# Altium schematic sheet LPCB220 - WATCHDOG.SchDoc
size A3; Address1: Factory 10; Address2: 9-13 Dingley Avenue, Dandeong, VICTORIA 3175, AUSTRALIA; DocumentNumber: 18; Revision: 1; SheetNumber: 18; SheetTotal: 18; Lockie__PCB_SUB_ASSEMBLY: Watchdog; Lockie__PCB_ASSEMBLY: Brake Control; Lockie__LDL: LPCB220; Lockie__PCB_DESCRIPTION: Redundant Stepper Node
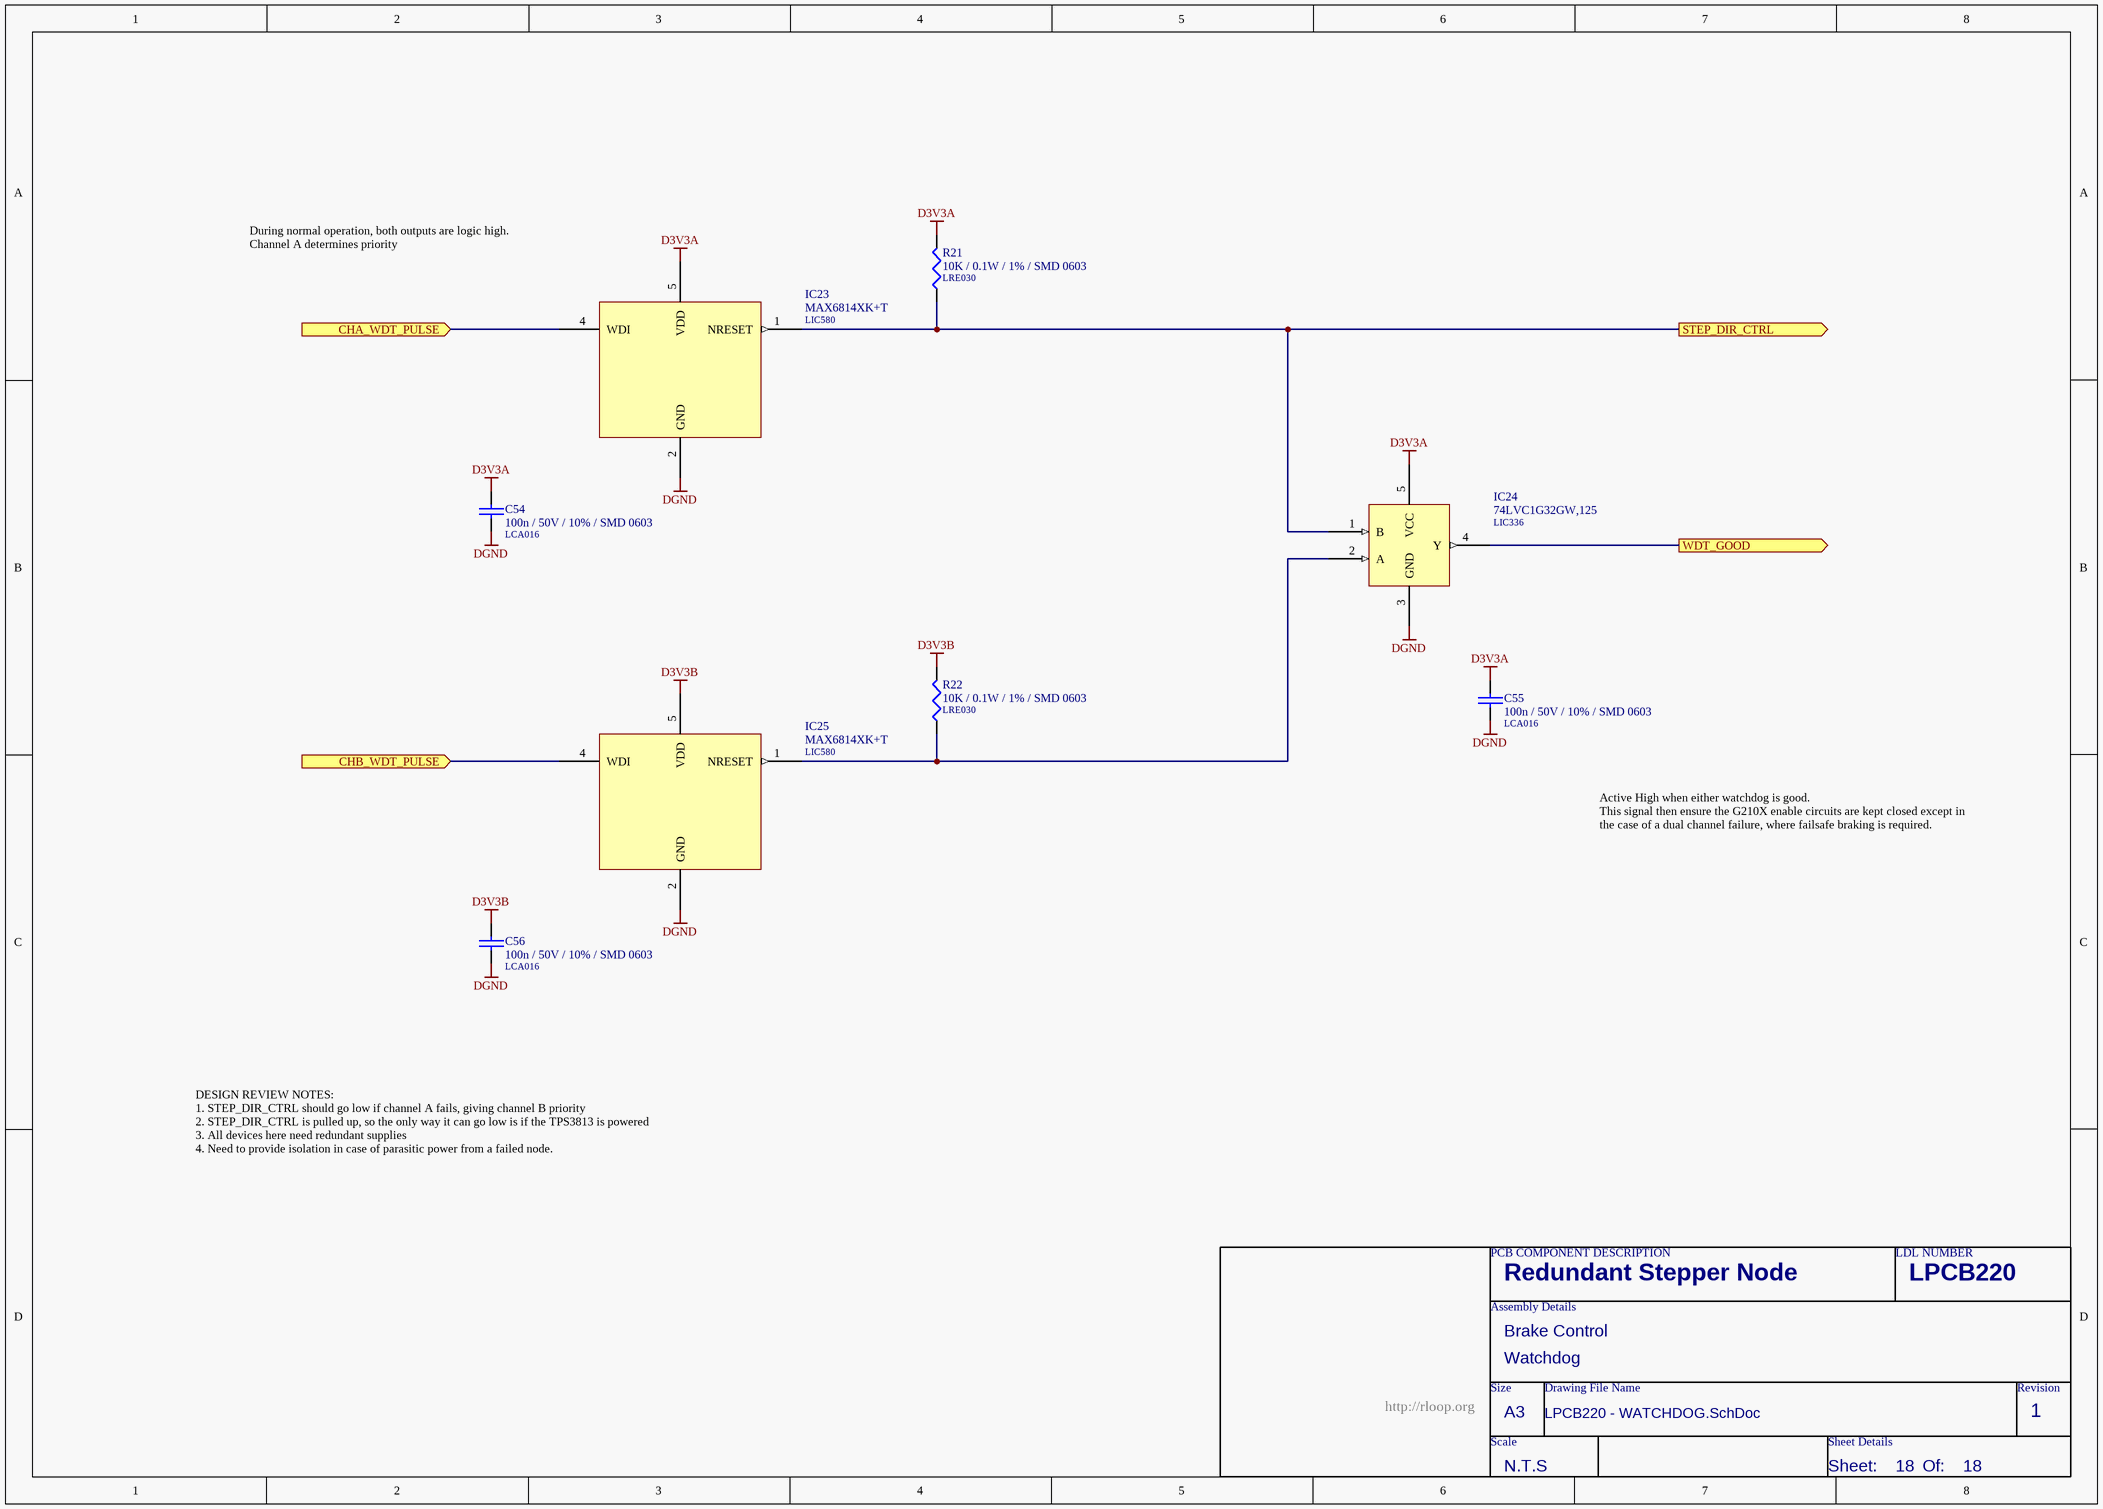
[diagram p0: LPCB220 - WATCHDOG.SchDoc]

## Parts
C54  100n / 50V / 10% / SMD 0603  LDL_NUMBER: LCA016  [LFP011__CC1608-0603-IPC7351_B]
C55  100n / 50V / 10% / SMD 0603  LDL_NUMBER: LCA016  [LFP011__CC1608-0603-IPC7351_B]
C56  100n / 50V / 10% / SMD 0603  LDL_NUMBER: LCA016  [LFP011__CC1608-0603-IPC7351_B]
IC23  MAX6814XK+T  LDL_NUMBER: LIC580  [LFP047__SOT353]
IC24  74LVC1G32GW,125  LDL_NUMBER: LIC336  [LFP047__SOT353]
IC25  MAX6814XK+T  LDL_NUMBER: LIC580  [LFP047__SOT353]
R21  10K / 0.1W / 1% / SMD 0603  LDL_NUMBER: LRE030  [LFP020__CR1608-0603-IPC7351_B]
R22  10K / 0.1W / 1% / SMD 0603  LDL_NUMBER: LRE030  [LFP020__CR1608-0603-IPC7351_B]

## Ports
CHA_WDT_PULSE (in), CHB_WDT_PULSE (in), STEP_DIR_CTRL (out), WDT_GOOD (out)

## Nets
D3V3A: C54.1 C55.1 IC23.5(VDD) IC24.5(VCC) R21.2
D3V3B: C56.1 IC25.5(VDD) R22.2
DGND: C54.2 C55.2 C56.2 IC23.2(GND) IC24.3(GND) IC25.2(GND)
CHA_WDT_PULSE: IC23.4(WDI) ; port CHA_WDT_PULSE
CHB_WDT_PULSE: IC25.4(WDI) ; port CHB_WDT_PULSE
STEP_DIR_CTRL: IC23.1(NRESET) IC24.1(B) R21.1 ; port STEP_DIR_CTRL
WDT_GOOD: IC24.4(Y) ; port WDT_GOOD
NetIC24_2: IC24.2(A) IC25.1(NRESET) R22.1

## Notes on the sheet
- During normal operation, both outputs are logic high.
  Channel A determines priority
- Active High when either watchdog is good.
  This signal then ensure the G210X enable circuits are kept closed except in
  the case of a dual channel failure, where failsafe braking is required.
- DESIGN REVIEW NOTES:
  1. STEP_DIR_CTRL should go low if channel A fails, giving channel B priority
  2. STEP_DIR_CTRL is pulled up, so the only way it can go low is if the TPS3813 is powered
  3. All devices here need redundant supplies
  4. Need to provide isolation in case of parasitic power from a failed node.
- PCB COMPONENT DESCRIPTION
- LDL NUMBER
- Assembly Details
- Size
- Drawing File Name
- Revision
- http://rloop.org
- Scale
- A3
- Sheet Details
- N.T.S
- Sheet:
- Of:

## Library data of the parts
C54-C56 = 100n / 50V / 10% / SMD 0603: Capacitor, Ceramic Chip, 100nF (0.1uF), 50V, 5%, SMD 0603 [LCA016]; FMEDA__OPERATING__VOLTAGE_MIN: 0; FMEDA__OPERATING__VOLTAGE_MAX: 3.3; FMEDA__OPERATING__TEMP_MIN: -20; FMEDA__OPERATING__TEMP_TYP: 27; FMEDA__OPERATING__TEMP_MAX: 50; FMEDA__CHANNEL: COM; Value: 100n; FMEDA__FUNCTION_IN_SYSTEM: *; FMEDA__OPERATING__VOLTAGE_TYP: 3.3
IC23 IC25 = MAX6814XK+T: IC, Watchdog, SMD [LIC580]; FMEDA__OPERATING__TEMP_MIN: -20; FMEDA__OPERATING__TEMP_TYP: 27; FMEDA__OPERATING__TEMP_MAX: 50; FMEDA__OPERATING__VOLTAGE_MIN: 0; FMEDA__OPERATING__VOLTAGE_TYP: 3.3; FMEDA__CHANNEL: COM; FMEDA__FUNCTION_IN_SYSTEM: *; FMEDA__OPERATING__VOLTAGE_MAX: 3.3
IC24 = 74LVC1G32GW,125: IC, Logic OR Gate, Single 2 Input, SMD SOT353 [LIC336]; FMEDA__OPERATING__TEMP_MAX: 50; FMEDA__OPERATING__TEMP_MIN: -20; FMEDA__OPERATING__TEMP_TYP: 27; FMEDA__OPERATING__VOLTAGE_MAX: 0; FMEDA__CHANNEL: COM; FMEDA__FUNCTION_IN_SYSTEM: *; FMEDA__OPERATING__VOLTAGE_MIN: 0; FMEDA__OPERATING__VOLTAGE_TYP: 0
R21 R22 = 10K / 0.1W / 1% / SMD 0603: Resistor, Ceramic Chip, 10K, 0.1W, 1%, SMD 0603 [LRE030]; FMEDA__OPERATING__POWER_MAX: 0; FMEDA__OPERATING__TEMP_MAX: 50; FMEDA__OPERATING__TEMP_MIN: -20; FMEDA__OPERATING__TEMP_TYP: 27; FMEDA__CHANNEL: COM; Value: 10K; FMEDA__OPERATING__POWER_MIN: 0; FMEDA__OPERATING__VOLTAGE_MAX: 0; FMEDA__OPERATING__VOLTAGE_MIN: 0; FMEDA__OPERATING__VOLTAGE_TYP: 0; FMEDA__FUNCTION_IN_SYSTEM: *